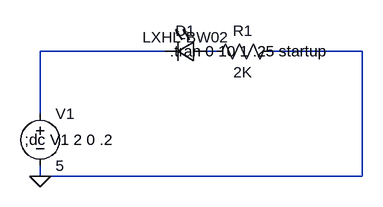
[diagram p0: schematic LED test circuit 3 feb27.asc]
LED test circuit 3 feb27.asc, the LTspice schematic file:
Version 4
SHEET 1 880 680
WIRE -224 48 -416 48
WIRE -144 48 -160 48
WIRE 80 48 -64 48
WIRE -416 144 -416 48
WIRE -416 240 -416 224
WIRE 80 240 80 48
WIRE 80 240 -416 240
FLAG -416 240 0
SYMBOL res -48 32 R90
WINDOW 0 0 56 VBottom 2
WINDOW 3 32 56 VTop 2
SYMATTR InstName R1
SYMATTR Value 2K
SYMATTR SpiceLine tol=1 pwr=0.25
SYMBOL LED -160 32 R90
WINDOW 0 0 32 VBottom 2
WINDOW 3 10 32 VBottom 2
SYMATTR InstName D1
SYMATTR Value LXHL-BW02
SYMBOL voltage -416 128 R0
WINDOW 123 0 0 Left 2
WINDOW 39 0 0 Left 2
SYMATTR InstName V1
SYMATTR Value 5
TEXT -440 184 Left 2 !;dc V1 2 0 .2
TEXT -216 48 Left 2 !.tran 0 10 1 .25 startup

The netlist it stands for:
* LED test circuit 3 feb27.asc
R1 0 N002 2K tol=1 pwr=0.25
D1 N002 N001 LXHL-BW02
V1 N001 0 5
.model D D
.lib standard.dio
;dc V1 2 0 .2
.tran 0 10 1 .25 startup
.backanno
.end